# Altium project H01R0.PrjPcb
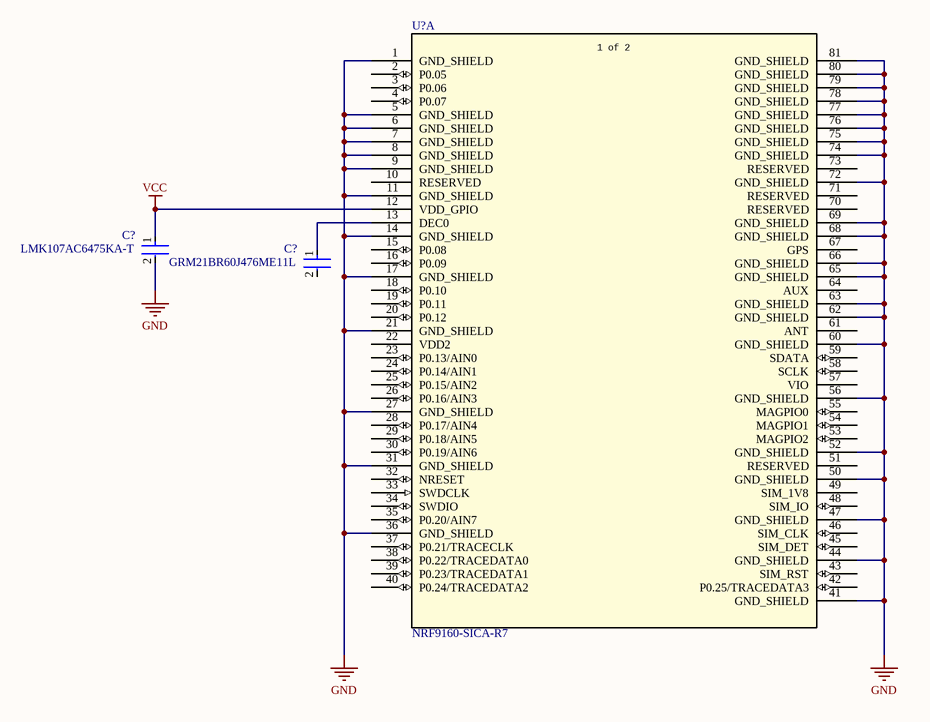
[diagram p0: H01R0_Frontend 1.SchDoc]
Module_Description: RGB LED; Module_Name: H01R0; revision: 0
2 sheets, 4 parts. Net scope: global (net labels, ports and power ports of the same name join across sheets).
Board file: H01R0.PcbDoc
Sheets:
  H01R0_Frontend 1.SchDoc
  H01R0_Frontend 2.SchDoc

## Sheet H01R0_Frontend 1.SchDoc
size Letter; CompanyName: Hexabitz; DocumentNumber: 2; SheetNumber: 2; SheetTotal: 3

### Parts
(Parts that share a designator on the sheet are numbered #1, #2 ... from top to bottom, then left to right.)
C?#1  LMK107AC6475KA-T  [FP-0603-L_1_6_0_15-W_0_8-MFG]
C?#2  GRM21BR60J476ME11L  [FP-GRM21B-0_2-e0_2_0_7-IPC_B]
U?#1  NRF9160-SICA-R7  [LGA127_16p00X10p50_nRF9160_NOR]  (part A of 2)

### Nets
GND: C?#1.2 U?#1.1(GND_SHIELD) U?#1.5(GND_SHIELD) U?#1.6(GND_SHIELD) U?#1.7(GND_SHIELD) U?#1.8(GND_SHIELD) U?#1.9(GND_SHIELD) U?#1.11(GND_SHIELD) U?#1.14(GND_SHIELD) U?#1.17(GND_SHIELD) U?#1.21(GND_SHIELD) U?#1.27(GND_SHIELD) U?#1.31(GND_SHIELD) U?#1.36(GND_SHIELD) U?#1.41(GND_SHIELD) U?#1.44(GND_SHIELD) U?#1.47(GND_SHIELD) U?#1.50(GND_SHIELD) U?#1.52(GND_SHIELD) U?#1.56(GND_SHIELD) U?#1.60(GND_SHIELD) U?#1.62(GND_SHIELD) U?#1.63(GND_SHIELD) U?#1.65(GND_SHIELD) U?#1.66(GND_SHIELD) U?#1.68(GND_SHIELD) U?#1.69(GND_SHIELD) U?#1.72(GND_SHIELD) U?#1.74(GND_SHIELD) U?#1.75(GND_SHIELD) U?#1.76(GND_SHIELD) U?#1.77(GND_SHIELD) U?#1.78(GND_SHIELD) U?#1.79(GND_SHIELD) U?#1.80(GND_SHIELD) U?#1.81(GND_SHIELD)
VCC: C?#1.1 U?#1.12(VDD_GPIO)
NetC?#2_1: C?#2.1 U?#1.13(DEC0)

Not connected (* = marked no-connect by the designer): C?#2 2; U?#1 2(P0.05) 3(P0.06) 4(P0.07) 10(RESERVED) 15(P0.08) 16(P0.09) 18(P0.10) 19(P0.11) 20(P0.12) 22(VDD2) 23(P0.13/AIN0) 24(P0.14/AIN1) 25(P0.15/AIN2) 26(P0.16/AIN3) 28(P0.17/AIN4) 29(P0.18/AIN5) 30(P0.19/AIN6) 32(NRESET) 33(SWDCLK) 34(SWDIO) 35(P0.20/AIN7) 37(P0.21/TRACECLK) 38(P0.22/TRACEDATA0) 39(P0.23/TRACEDATA1) 40(P0.24/TRACEDATA2) 42(P0.25/TRACEDATA3) 43(SIM_RST) 45(SIM_DET) 46(SIM_CLK) 48(SIM_IO) 49(SIM_1V8) 51(RESERVED) 53(MAGPIO2) 54(MAGPIO1) 55(MAGPIO0) 57(VIO) 58(SCLK) 59(SDATA) 61(ANT) 64(AUX) 67(GPS) 70(RESERVED) 71(RESERVED) 73(RESERVED)

### Notes on the sheet
- Module:
- Title:
- Description:
- Size:
- Revision:
- Letter
- www.hexabitz.com
- Date:
- Time:
- Sheet
- of
- (in symbol CMP-006-000000-1, part A) 1 of 2

### Library data of the parts
C?#1 = CMP-14477-003024-3: Ceramic Capacitor General Use 4.7uF ±10% 10V X6S 0603; NexarPartId: 75346097; Capacitance: 4.7µF; Material: Ceramic; Voltage Rating (DC): 10V; Case/Package: 0603; Height: 950µm; Max Operating Temperature: 105°C; RoHS: Non-Compliant; Tolerance: 10%; Min Operating Temperature: -55°C; Voltage Rating: 10V
C?#2 = CMP-06035-028650-1: Chip Multilayer Ceramic Capacitors for General Purpose, 0805, 47uF, X5R, 15%, 20%, 6.3V; Tolerance: 20%; Case/Package: 0805; Length: 2mm; Thickness: 1.25mm; Dielectric: X5R; Width: 1.25mm; Capacitance: 47uF; Voltage Rating (DC): 6.3V
U?#1 = CMP-006-000000-1: Description; Manufacturer_Name: Nordic Semiconductor; Type: RF; Manufacturer_Part_Number: NRF9160-SICA-R7; RefDes: RefDes; Design Item ID: NRF9160-SICA-R7; Source: NRF9160-SICA-R7.SchLib; Copyright: Copyright (C) 2025 Ultra Librarian. All rights reserved.

## Sheet H01R0_Frontend 2.SchDoc
size Letter; CompanyName: Hexabitz; DocumentNumber: 3; SheetNumber: 3; SheetTotal: 3
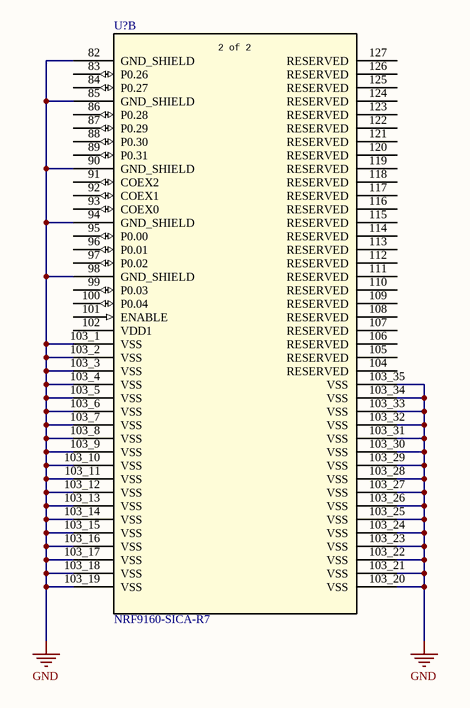
[diagram p1: H01R0_Frontend 2.SchDoc]

### Parts
(Parts that share a designator on the sheet are numbered #1, #2 ... from top to bottom, then left to right.)
U?#2  NRF9160-SICA-R7  [LGA127_16p00X10p50_nRF9160_NOR]  (part B of 2)

### Nets
GND: U?#2.82(GND_SHIELD) U?#2.85(GND_SHIELD) U?#2.90(GND_SHIELD) U?#2.94(GND_SHIELD) U?#2.98(GND_SHIELD) U?#2.103_1(VSS) U?#2.103_2(VSS) U?#2.103_3(VSS) U?#2.103_4(VSS) U?#2.103_5(VSS) U?#2.103_6(VSS) U?#2.103_7(VSS) U?#2.103_8(VSS) U?#2.103_9(VSS) U?#2.103_10(VSS) U?#2.103_11(VSS) U?#2.103_12(VSS) U?#2.103_13(VSS) U?#2.103_14(VSS) U?#2.103_15(VSS) U?#2.103_16(VSS) U?#2.103_17(VSS) U?#2.103_18(VSS) U?#2.103_19(VSS) U?#2.103_20(VSS) U?#2.103_21(VSS) U?#2.103_22(VSS) U?#2.103_23(VSS) U?#2.103_24(VSS) U?#2.103_25(VSS) U?#2.103_26(VSS) U?#2.103_27(VSS) U?#2.103_28(VSS) U?#2.103_29(VSS) U?#2.103_30(VSS) U?#2.103_31(VSS) U?#2.103_32(VSS) U?#2.103_33(VSS) U?#2.103_34(VSS) U?#2.103_35(VSS)

Not connected (* = marked no-connect by the designer): U?#2 83(P0.26) 84(P0.27) 86(P0.28) 87(P0.29) 88(P0.30) 89(P0.31) 91(COEX2) 92(COEX1) 93(COEX0) 95(P0.00) 96(P0.01) 97(P0.02) 99(P0.03) 100(P0.04) 101(ENABLE) 102(VDD1) 104(RESERVED) 105(RESERVED) 106(RESERVED) 107(RESERVED) 108(RESERVED) 109(RESERVED) 110(RESERVED) 111(RESERVED) 112(RESERVED) 113(RESERVED) 114(RESERVED) 115(RESERVED) 116(RESERVED) 117(RESERVED) 118(RESERVED) 119(RESERVED) 120(RESERVED) 121(RESERVED) 122(RESERVED) 123(RESERVED) 124(RESERVED) 125(RESERVED) 126(RESERVED) 127(RESERVED)

### Notes on the sheet
- Module:
- Title:
- Description:
- Size:
- Revision:
- Letter
- www.hexabitz.com
- Date:
- Time:
- Sheet
- of
- (in symbol CMP-006-000000-1, part B) 2 of 2

### Library data of the parts
U?#2 = CMP-006-000000-1: as U?#1 on sheet H01R0_Frontend 1; Type: RF; Manufacturer_Part_Number: NRF9160-SICA-R7; RefDes: RefDes; Design Item ID: NRF9160-SICA-R7; Source: NRF9160-SICA-R7.SchLib; Copyright: Copyright (C) 2025 Ultra Librarian. All rights reserved.

## Nets that join several sheets
GND: H01R0_Frontend 1 (36 pins), H01R0_Frontend 2 (40 pins)